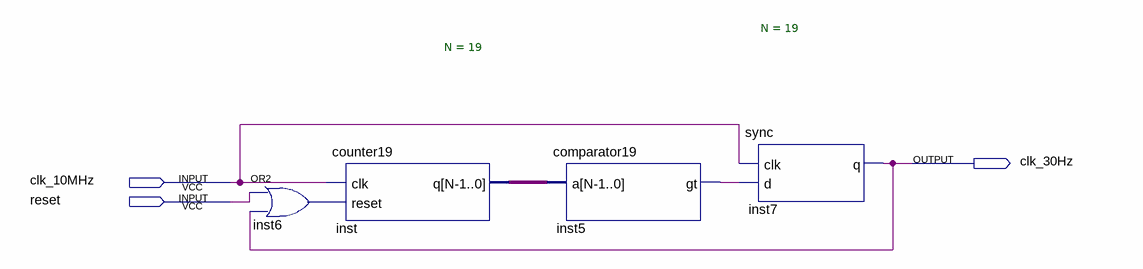
[diagram p0: schematic sheet]
// Quartus schematic clkadjust30.bdf as structural Verilog: 4 symbols, 3 pins
module clkadjust30 (
  input  clk_10MHz,
  input  reset,
  output clk_30Hz
);

  wire inst5_gt, inst6_out;
  wire [18:0] inst_q;

  or inst6 (inst6_out, reset, clk_30Hz);
  counter19 #(.N(19)) inst (.clk(clk_10MHz), .reset(inst6_out), .q(inst_q));
  comparator19 #(.N(19)) inst5 (.a(inst_q), .gt(inst5_gt));
  sync inst7 (.clk(clk_10MHz), .d(inst5_gt), .q(clk_30Hz));
endmodule
